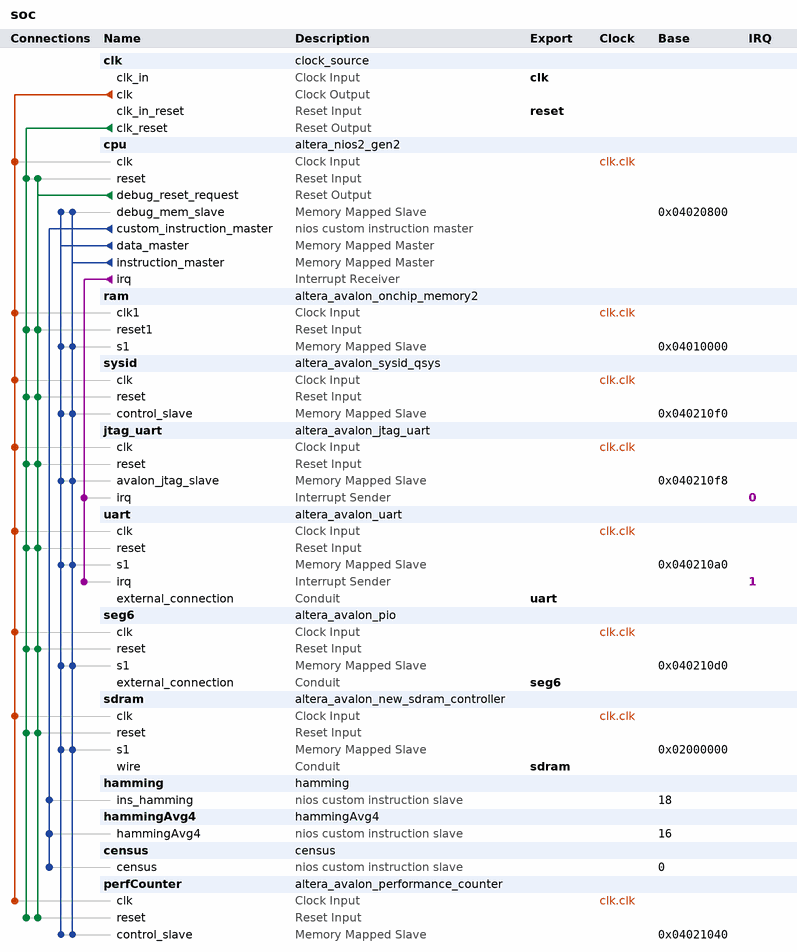
[diagram p0: system contents]
# Platform Designer (Qsys) system soc, Cyclone IV E EP4CE15F17C8
# Parameters at their usual value, and those the tool derives, are not listed.
package require -exact qsys 15.1
create_system soc
set_project_property DEVICE_FAMILY {Cyclone IV E}
set_project_property DEVICE EP4CE15F17C8

add_instance clk clock_source 15.1
set_instance_parameter_value clk clockFrequency 100000000

add_instance cpu altera_nios2_gen2 15.1
set_instance_parameter_value cpu dcache_size 2048
set_instance_parameter_value cpu exceptionSlave sdram.s1
set_instance_parameter_value cpu icache_size 4096
set_instance_parameter_value cpu impl Fast
set_instance_parameter_value cpu resetSlave sdram.s1

add_instance ram altera_avalon_onchip_memory2 15.1
set_instance_parameter_value ram dataWidth 32
set_instance_parameter_value ram dualPort false
set_instance_parameter_value ram initMemContent true
set_instance_parameter_value ram initializationFileName onchip_mem.hex
set_instance_parameter_value ram memorySize 40960

add_instance sysid altera_avalon_sysid_qsys 15.1
set_instance_parameter_value sysid id 563

add_instance jtag_uart altera_avalon_jtag_uart 15.1
set_instance_parameter_value jtag_uart readBufferDepth 256
set_instance_parameter_value jtag_uart simInteractiveOptions NO_INTERACTIVE_WINDOWS
set_instance_parameter_value jtag_uart writeBufferDepth 256

add_instance uart altera_avalon_uart 15.1
set_instance_parameter_value uart baud 115200
set_instance_parameter_value uart dataBits 8
set_instance_parameter_value uart fixedBaud true
set_instance_parameter_value uart parity NONE
set_instance_parameter_value uart stopBits 1

add_instance seg6 altera_avalon_pio 15.1
set_instance_parameter_value seg6 direction Output
set_instance_parameter_value seg6 width 24

add_instance sdram altera_avalon_new_sdram_controller 15.1
set_instance_parameter_value sdram TAC 5.4
set_instance_parameter_value sdram TRCD 20.0
set_instance_parameter_value sdram TRFC 65.0
set_instance_parameter_value sdram TRP 20.0
set_instance_parameter_value sdram TWR 20.0
set_instance_parameter_value sdram casLatency 3
set_instance_parameter_value sdram columnWidth 9
set_instance_parameter_value sdram dataWidth 16
set_instance_parameter_value sdram generateSimulationModel false
set_instance_parameter_value sdram initRefreshCommands 8
set_instance_parameter_value sdram model single_Micron_MT48LC4M32B2_7_chip
set_instance_parameter_value sdram numberOfBanks 4
set_instance_parameter_value sdram numberOfChipSelects 1
set_instance_parameter_value sdram powerUpDelay 200.0
set_instance_parameter_value sdram refreshPeriod 7.8125
set_instance_parameter_value sdram rowWidth 13

add_instance hamming hamming 1.0

add_instance hammingAvg4 hammingAvg4 1.0

add_instance census census 1.4

add_instance perfCounter altera_avalon_performance_counter 15.1
set_instance_parameter_value perfCounter numberOfSections 3

# connections
add_connection clk.clk cpu.clk clock
add_connection clk.clk jtag_uart.clk clock
add_connection clk.clk perfCounter.clk clock
add_connection clk.clk ram.clk1 clock
add_connection clk.clk sdram.clk clock
add_connection clk.clk seg6.clk clock
add_connection clk.clk sysid.clk clock
add_connection clk.clk uart.clk clock
add_connection clk.clk_reset cpu.reset reset
add_connection clk.clk_reset jtag_uart.reset reset
add_connection clk.clk_reset perfCounter.reset reset
add_connection clk.clk_reset ram.reset1 reset
add_connection clk.clk_reset sdram.reset reset
add_connection clk.clk_reset seg6.reset reset
add_connection clk.clk_reset sysid.reset reset
add_connection clk.clk_reset uart.reset reset
add_connection cpu.debug_reset_request cpu.reset reset
add_connection cpu.debug_reset_request jtag_uart.reset reset
add_connection cpu.debug_reset_request perfCounter.reset reset
add_connection cpu.debug_reset_request ram.reset1 reset
add_connection cpu.debug_reset_request sdram.reset reset
add_connection cpu.debug_reset_request seg6.reset reset
add_connection cpu.debug_reset_request sysid.reset reset
add_connection cpu.debug_reset_request uart.reset reset
add_connection cpu.data_master cpu.debug_mem_slave avalon
set_connection_parameter_value cpu.data_master/cpu.debug_mem_slave baseAddress 0x04020800
add_connection cpu.data_master jtag_uart.avalon_jtag_slave avalon
set_connection_parameter_value cpu.data_master/jtag_uart.avalon_jtag_slave baseAddress 0x040210f8
add_connection cpu.data_master perfCounter.control_slave avalon
set_connection_parameter_value cpu.data_master/perfCounter.control_slave baseAddress 0x04021040
add_connection cpu.data_master ram.s1 avalon
set_connection_parameter_value cpu.data_master/ram.s1 baseAddress 0x04010000
add_connection cpu.data_master sdram.s1 avalon
set_connection_parameter_value cpu.data_master/sdram.s1 baseAddress 0x02000000
add_connection cpu.data_master seg6.s1 avalon
set_connection_parameter_value cpu.data_master/seg6.s1 baseAddress 0x040210d0
add_connection cpu.data_master sysid.control_slave avalon
set_connection_parameter_value cpu.data_master/sysid.control_slave baseAddress 0x040210f0
add_connection cpu.data_master uart.s1 avalon
set_connection_parameter_value cpu.data_master/uart.s1 baseAddress 0x040210a0
add_connection cpu.instruction_master cpu.debug_mem_slave avalon
set_connection_parameter_value cpu.instruction_master/cpu.debug_mem_slave baseAddress 0x04020800
add_connection cpu.instruction_master jtag_uart.avalon_jtag_slave avalon
set_connection_parameter_value cpu.instruction_master/jtag_uart.avalon_jtag_slave baseAddress 0x040210f8
add_connection cpu.instruction_master perfCounter.control_slave avalon
set_connection_parameter_value cpu.instruction_master/perfCounter.control_slave baseAddress 0x04021040
add_connection cpu.instruction_master ram.s1 avalon
set_connection_parameter_value cpu.instruction_master/ram.s1 baseAddress 0x04010000
add_connection cpu.instruction_master sdram.s1 avalon
set_connection_parameter_value cpu.instruction_master/sdram.s1 baseAddress 0x02000000
add_connection cpu.instruction_master seg6.s1 avalon
set_connection_parameter_value cpu.instruction_master/seg6.s1 baseAddress 0x040210d0
add_connection cpu.instruction_master sysid.control_slave avalon
set_connection_parameter_value cpu.instruction_master/sysid.control_slave baseAddress 0x040210f0
add_connection cpu.instruction_master uart.s1 avalon
set_connection_parameter_value cpu.instruction_master/uart.s1 baseAddress 0x040210a0
add_connection cpu.irq jtag_uart.irq interrupt
set_connection_parameter_value cpu.irq/jtag_uart.irq irqNumber 0
add_connection cpu.irq uart.irq interrupt
set_connection_parameter_value cpu.irq/uart.irq irqNumber 1
add_connection cpu.custom_instruction_master census.census nios_custom_instruction
set_connection_parameter_value cpu.custom_instruction_master/census.census CIName census
set_connection_parameter_value cpu.custom_instruction_master/census.census baseAddress 0
add_connection cpu.custom_instruction_master hamming.ins_hamming nios_custom_instruction
set_connection_parameter_value cpu.custom_instruction_master/hamming.ins_hamming CIName hamming
set_connection_parameter_value cpu.custom_instruction_master/hamming.ins_hamming baseAddress 18
add_connection cpu.custom_instruction_master hammingAvg4.hammingAvg4 nios_custom_instruction
set_connection_parameter_value cpu.custom_instruction_master/hammingAvg4.hammingAvg4 CIName hammingavg4
set_connection_parameter_value cpu.custom_instruction_master/hammingAvg4.hammingAvg4 baseAddress 16

# exported interfaces
add_interface clk clock sink
set_interface_property clk EXPORT_OF clk.clk_in
add_interface reset reset sink
set_interface_property reset EXPORT_OF clk.clk_in_reset
add_interface sdram conduit end
set_interface_property sdram EXPORT_OF sdram.wire
add_interface seg6 conduit end
set_interface_property seg6 EXPORT_OF seg6.external_connection
add_interface uart conduit end
set_interface_property uart EXPORT_OF uart.external_connection

set_interconnect_requirement {$system} qsys_mm.clockCrossingAdapter HANDSHAKE
set_interconnect_requirement {$system} qsys_mm.enableEccProtection FALSE
set_interconnect_requirement {$system} qsys_mm.insertDefaultSlave FALSE
set_interconnect_requirement {$system} qsys_mm.maxAdditionalLatency 1

save_system soc.qsys
